# EAGLE design schematic (EAGLE 7.1.0)
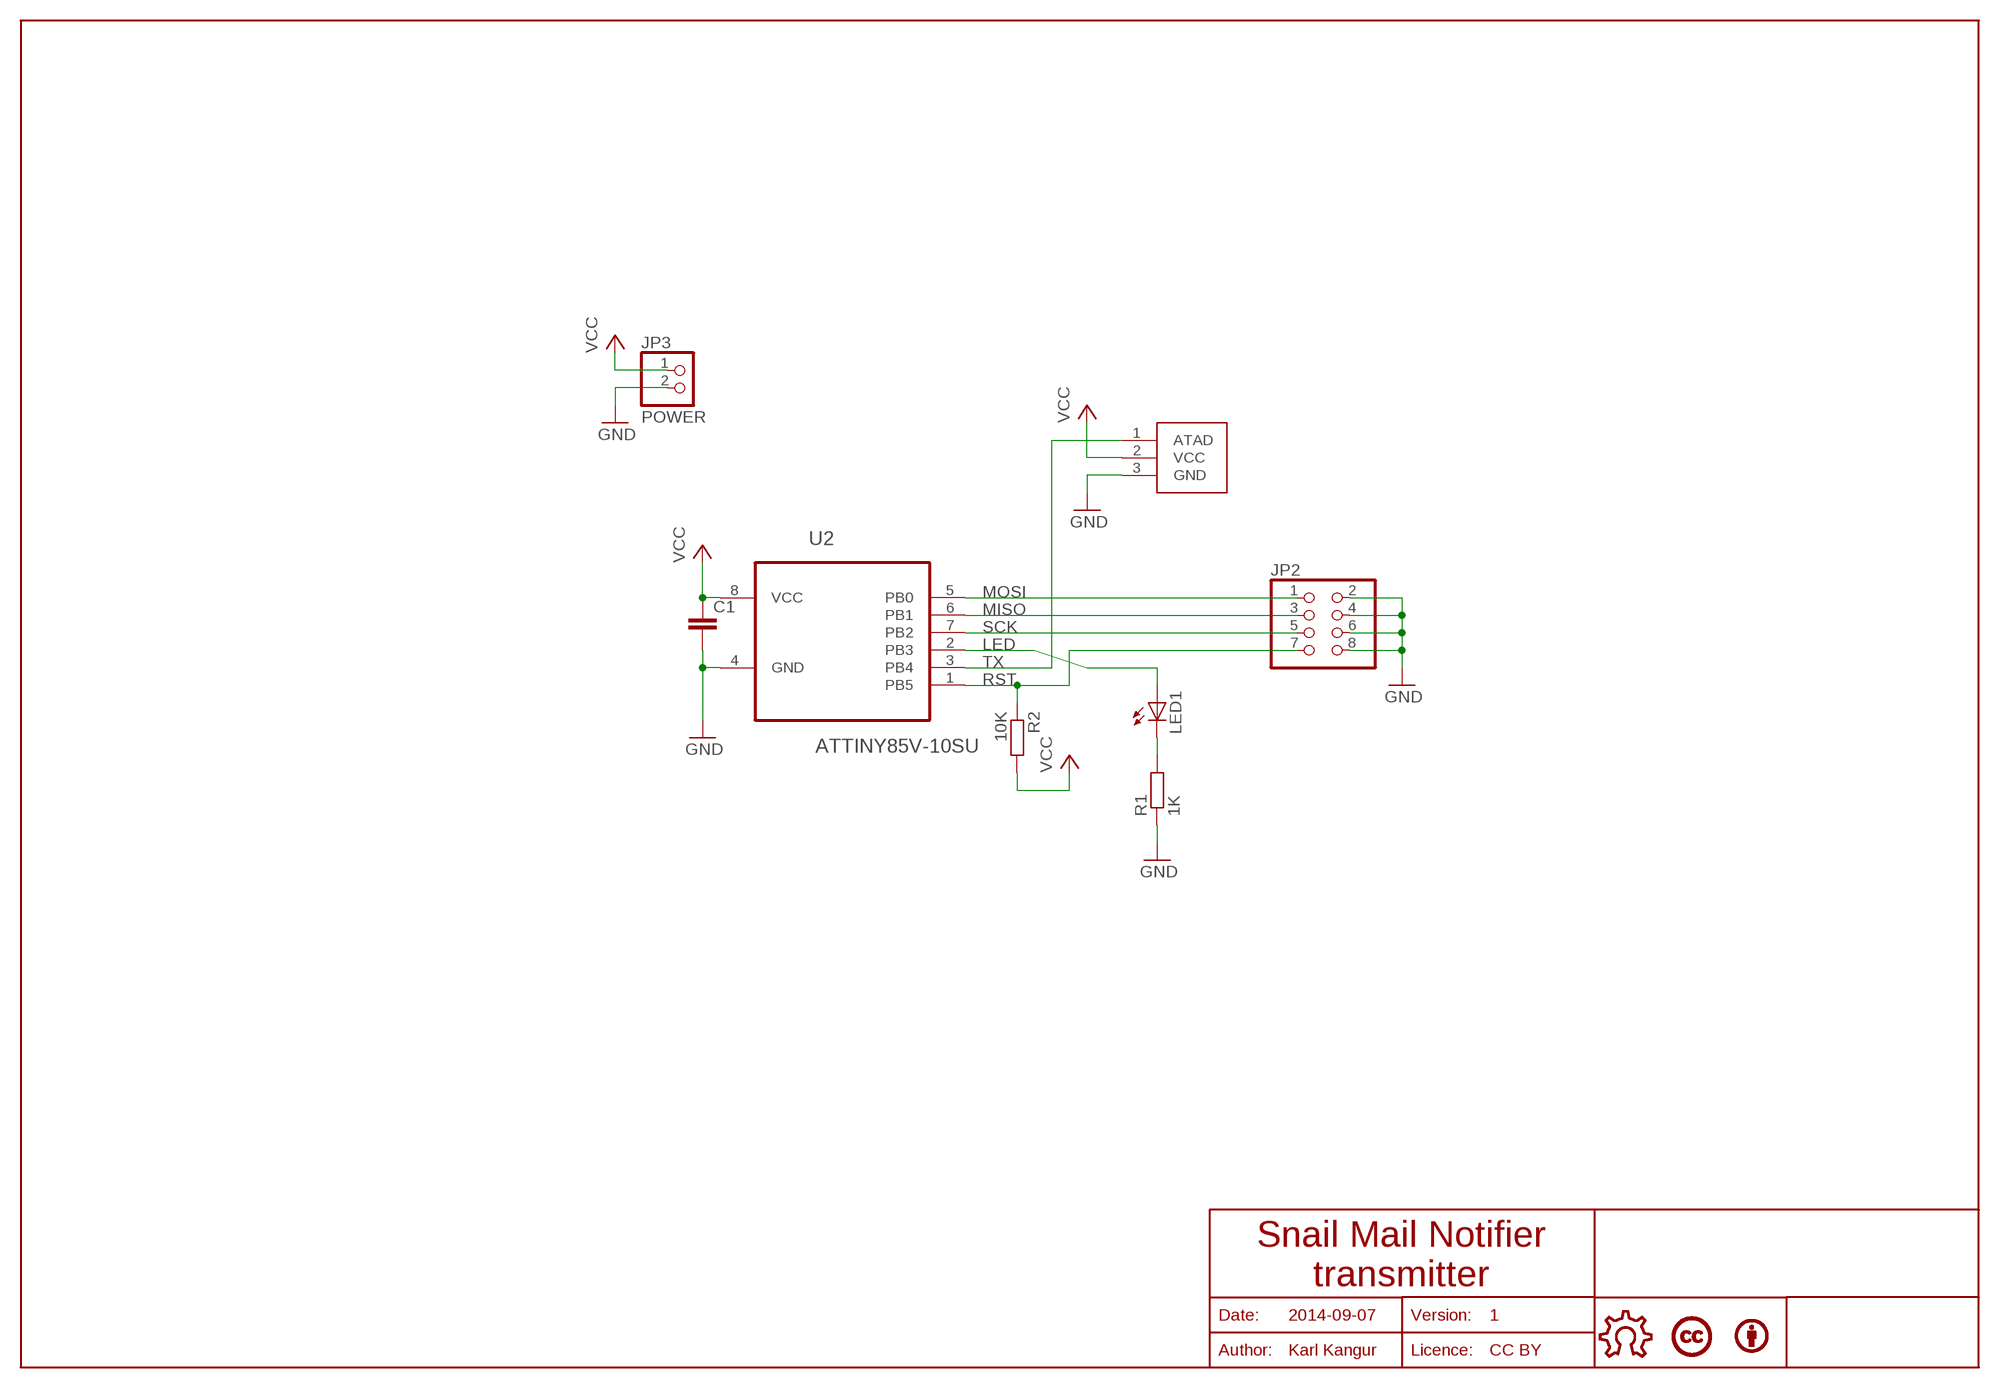
[diagram p0: schematic, sheet 1]

## Parts
BY1  BYBOTTOM  [BY]
C1  C-EUC0805  [C0805]
JP2  PINHD-2X4  [2X04]
JP3  POWER  PINHD-1X2  [1X02]
LED1  LED3MM  [LED3MM]
LICENCE1  LICENCECC-BOTTOM  [CREATIVE-COMMONS]
R1  1K  R-EU_R0805  [R0805]
R2  10K  R-EU_R0805  [R0805]
U2  ATTINY85V-10SU  [SOIC127P798X216-8N]
U$1  RF_LINK_TRANSMITTER  [RF_LINK_TRANSMITTER]
U$5  OPEN-HARDWARE-LOGOBOTTOM-SMALL  [OPEN-HARDWARE-BOTTOM-SMALL]

## Nets
GND: C1.2 JP2.2 JP2.4 JP2.6 JP2.8 JP3.2 R1.1 U2.4(GND) U$1.3(GND)
LED: LED1.A U2.2(PB3)
MISO: JP2.3 U2.6(PB1)
MOSI: JP2.1 U2.5(PB0)
N$1: LED1.K(C) R1.2
RST: JP2.7 R2.1 U2.1(PB5)
SCK: JP2.5 U2.7(PB2)
TX: U2.3(PB4) U$1.1(ATAD)
VCC: C1.1 JP3.1 R2.2 U2.8(VCC) U$1.2(VCC)

## Notes on the sheet
- Snail Mail Notifier
  transmitter
- Date: | 2014-09-07 | Version: | 1
- Author: | Karl Kangur | Licence: | CC BY

## Library data of the parts
BY1 = robopoly:BY
C1 = rcl:C-EU: CAPACITOR, European symbol
JP2 = pinhead:PINHD-2X4: PIN HEADER
JP3 = pinhead:PINHD-1X2: PIN HEADER
LED1 = led:LED: LED OSRAM: - CHIPLED LG R971, LG N971, LY N971, LG Q971, LY Q971, LO R971, LY R971 LH N974, LH R974 LS Q976, LO Q976, LY Q976 LO Q996 - Hyper CHIPLED LW Q18S LB Q993, LB Q99A, LB R99A - SideLED LS A670, LO A670, LY A670, LG A670, LP A670 LB A673, LV A673, LT A673, LW A673 LH A674 LY A675 LS A676, LA A676, LO A676, LY A676, LW A676 LS A679, LY A679, LG A679 - Hyper Micro SIDELED® LS Y876, LA Y876, LO Y876, LY Y876 LT Y87S - SmartLED LW L88C, LW L88S LB L89C, LB L89S, LG L890 LS L89K, LO L89K, LY L89K LS L896, LA L896, LO L896, LY L896 - TOPLED LS T670, LO T670, LY T670, LG T670, LP T670 LSG T670, LSP T670, LSY T670, LOP T670, LYG T670 LG T671, LOG T671, LSG T671 LB T673, LV T673, LT T673, LW T673 LH T674 LS T676, LA T676, LO T676, LY T676, LB T676, LH T676, LSB T676, LW T676 LB T67C, LV T67C, LT T67C, LS T67K, LO T67K, LY T67K, LW E67C LS E67B, LA E67B, LO E67B, LY E67B, LB E67C, LV E67C, LT E67C LW T67C LS T679, LY T679, LG T679 LS T770, LO T770, LY T770, LG T770, LP T770 LB T773, LV T773, LT T773, LW T773 LH T774 LS E675, LA E675, LY E675, LS T675 LS T776, LA T776, LO T776, LY T776, LB T776 LHGB T686 LT T68C, LB T68C - Hyper Mini TOPLED® LB M676 - Mini TOPLED Santana® LG M470 LS M47K, LO M47K, LY M47K Source: http://www.osram.convergy.de LUXEON: - LUMILED® LXK2-PW12-R00, LXK2-PW12-S00, LXK2-PW14-U00, LXK2-PW14-V00 LXK2-PM12-R00, LXK2-PM12-S00, LXK2-PM14-U00 LXK2-PE12-Q00, LXK2-PE12-R00, LXK2-PE12-S00, LXK2-PE14-T00, LXK2-PE14-U00 LXK2-PB12-K00, LXK2-PB12-L00, LXK2-PB12-M00, LXK2-PB14-N00, LXK2-PB14-P00, LXK2-PB14-Q00 LXK2-PR12-L00, LXK2-PR12-M00, LXK2-PR14-Q00, LXK2-PR14-R00 LXK2-PD12-Q00, LXK2-PD12-R00, LXK2-PD12-S00 LXK2-PH12-R00, LXK2-PH12-S00 LXK2-PL12-P00, LXK2-PL12-Q00, LXK2-PL12-R00 Source: www.luxeon.com KINGBRIGHT: KA-3528ASYC Source: www.kingbright.com
LICENCE1 = robopoly:LICENCE
R1 R2 = resistor:R-EU_: RESISTOR, European symbol
U2 = Atmel_By_element14_Batch_1-00:ATTINY85V-10SU: 8-bit Microcontroller with In-System Programmable Flash; MPN: ATTINY85V-10SU; OC_FARNELL: 1455166; OC_NEWARK: 58M3799; PACKAGE: SOIC-8; SUPPLIER: Atmel
U$1 = robopoly:RF_LINK_TRANSMITTER
U$5 = robopoly:OPEN-HARDWARE-LOGO

## Board
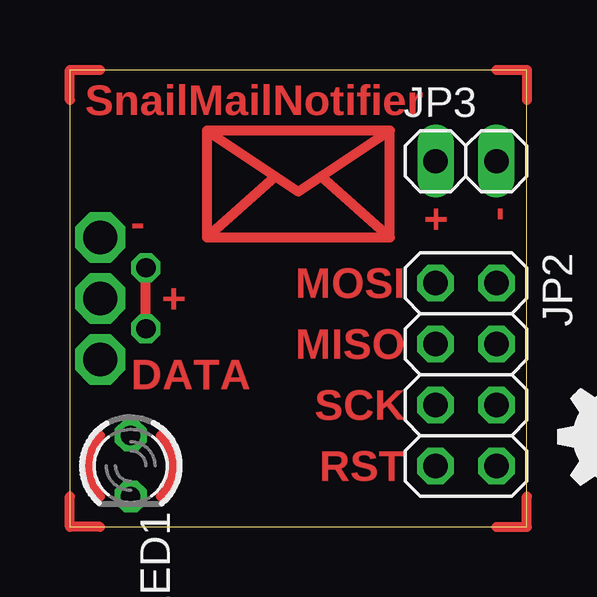
[diagram p1: board, top side]
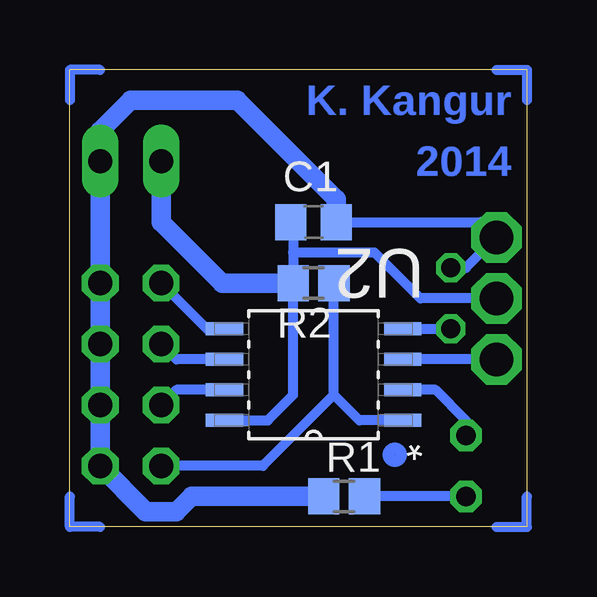
[diagram p2: board, bottom side, seen from below]

Size 19.05 x 19.05 mm. Coordinates in mm from the lower left corner, seen from the top.
Outline: 0,0 19.05,0 19.05,19.05 0,19.05 0,0
Copper layers (1*16): Top 0.035mm / dielectric 1.5mm / Bottom 0.035mm
Design rules "default": minimum track width 10mil, minimum drill 24mil, track to track 8mil, track to pad 8mil, pad to pad 8mil, via to via 8mil, smd to smd 8mil, copper to edge 40mil, drill to drill 8mil, minimum pad ring 10mil, minimum via ring 8mil, stop-mask expansion 4mil, vias tented up to drill 0mil, thermal gap 10mil

### Footprints (pad centres in the part's own frame; a part is rotated, then mirrored left to right if it is on the bottom)
C0805 = smd 1.3 x 1.5: 1 -0.95,0; 2 0.95,0
2X04 = drill 1.016 octagon: 1 -3.81,-1.27; 2 -3.81,1.27; 3 -1.27,-1.27; 4 -1.27,1.27; 5 1.27,-1.27; 6 1.27,1.27; 7 3.81,-1.27; 8 3.81,1.27
1X02 = drill 1.016 long: 1 -1.27,0; 2 1.27,0
LED3MM = drill 0.813 octagon: A -1.27,0; K 1.27,0
R0805 = smd 1.3 x 1.5: 1 -0.85,0; 2 0.85,0
SOIC127P798X216-8N = smd 1.549 x 0.533: 1 -3.708,1.905; 2 -3.708,0.635; 3 -3.708,-0.635; 4 -3.708,-1.905; 5 3.708,-1.905; 6 3.708,-0.635; 7 3.708,0.635; 8 3.708,1.905
RF_LINK_TRANSMITTER = drill 1.4 octagon: 1 6.985,1.27; 2 9.525,1.27; 3 12.065,1.27

### Placement (x,y rotation side)
BY1  34.92,3.81 0 bottom  (outside the outline)
C1  8.89,12.7 0 bottom
JP2  16.51,6.35 270 top
JP3  16.51,15.24 0 top
LED1  2.54,2.54 270 top
LICENCE1  29.21,3.81 0 bottom  (outside the outline)
R1  7.62,1.27 0 bottom
R2  8.89,10.16 180 bottom
U2  8.89,6.35 180 bottom
U$1  0,0 90 bottom
U$5  22.86,3.81 0 bottom  (outside the outline)

### Tracks (layer width: path | path; a pad name or v marks a point on that pad's centre or on a via)
GND  (via drill 0.8)
  Top 0.406: v3.17,8.26 v3.17,10.79
  Bottom 0.406: U2.4 v3.17,8.26 | C1.2 1.91,12.7 U$1.3 2.54,10.79 v3.17,10.79
  Bottom 0.813: R1.1 13.97,1.27 14.61,0.64 15.88,0.64 JP2.8 JP2.6 JP2.4 JP2.2 JP3.2 17.78,16.51 16.51,17.78 12.06,17.78 7.94,13.65 C1.2
LED
  Bottom 0.406: LED1.A 2.54,4.45 3.81,5.71 U2.2
MISO
  Bottom 0.406: U2.6 14.61,6.99 JP2.3
MOSI
  Bottom 0.406: U2.5 13.34,8.26 JP2.1
N$1
  Bottom 0.406: LED1.K R1.2
N$2
  Top 0.406: 0,17.78 0,19.05 1.27,19.05
N$3
  Top 0.406: 17.78,19.05 19.05,19.05 19.05,17.78
N$4
  Top 0.406: 17.78,0 19.05,0 19.05,1.27
N$5
  Top 0.406: 1.27,0 0,0 0,1.27
N$6
  Bottom 0.406: 1.27,19.05 0,19.05 0,17.78
N$7
  Bottom 0.406: 17.78,19.05 19.05,19.05 19.05,17.78
N$8
  Bottom 0.406: 17.78,0 19.05,0 19.05,1.27
N$9
  Bottom 0.406: 1.27,0 0,0 0,1.27
N$10
  Top 0.406: 1.27,1.27 arc-90 1.27,3.81
N$11
  Top 0.406: 5.71,12.06 13.34,12.06 | 13.34,12.06 13.34,16.51 | 13.34,16.51 5.71,16.51 | 5.71,16.51 5.71,12.06 | 5.71,16.51 8.57,14.61 | 8.57,14.61 9.53,13.97 10.48,14.61 | 10.48,14.61 13.34,16.51 | 13.34,12.06 10.48,14.61 | 8.57,14.61 5.71,12.06
N$12
  Top 0.406: 3.81,3.81 arc-90 3.81,1.27
RST
  Bottom 0.406: U2.1 6.99,4.45 8.04,5.5 | 8.04,5.5 R2.1 | 8.04,5.5 11,2.54 JP2.7
SCK
  Bottom 0.406: U2.7 14.61,5.71 JP2.5
TX
  Bottom 0.406: U$1.1 U2.3
VCC
  Bottom 0.406: U2.8 10.79,4.45 9.74,5.5 R2.2 9.74,11.43 | U$1.2 4.45,9.53 6.35,11.43 9.74,11.43 | C1.1 9.74,12.6 9.74,11.43
  Bottom 0.813: R2.2 12.7,10.16 15.24,12.7 JP3.1
(copper drawn outside any net)
  shapes: Bottom circle x1

### Text on the board
Top: SnailMailNotifier | - | + | - | + | MOSI | MISO | DATA | SCK | RST
Bottom: K. Kangur | 2014
Document: Snail Mail Notifier transmitter | Version: 1 | 2014-09-11 | Author: Karl Kangur | Licence: CC-BY